# EAGLE design pentabug_1layer (EAGLE 6.2)
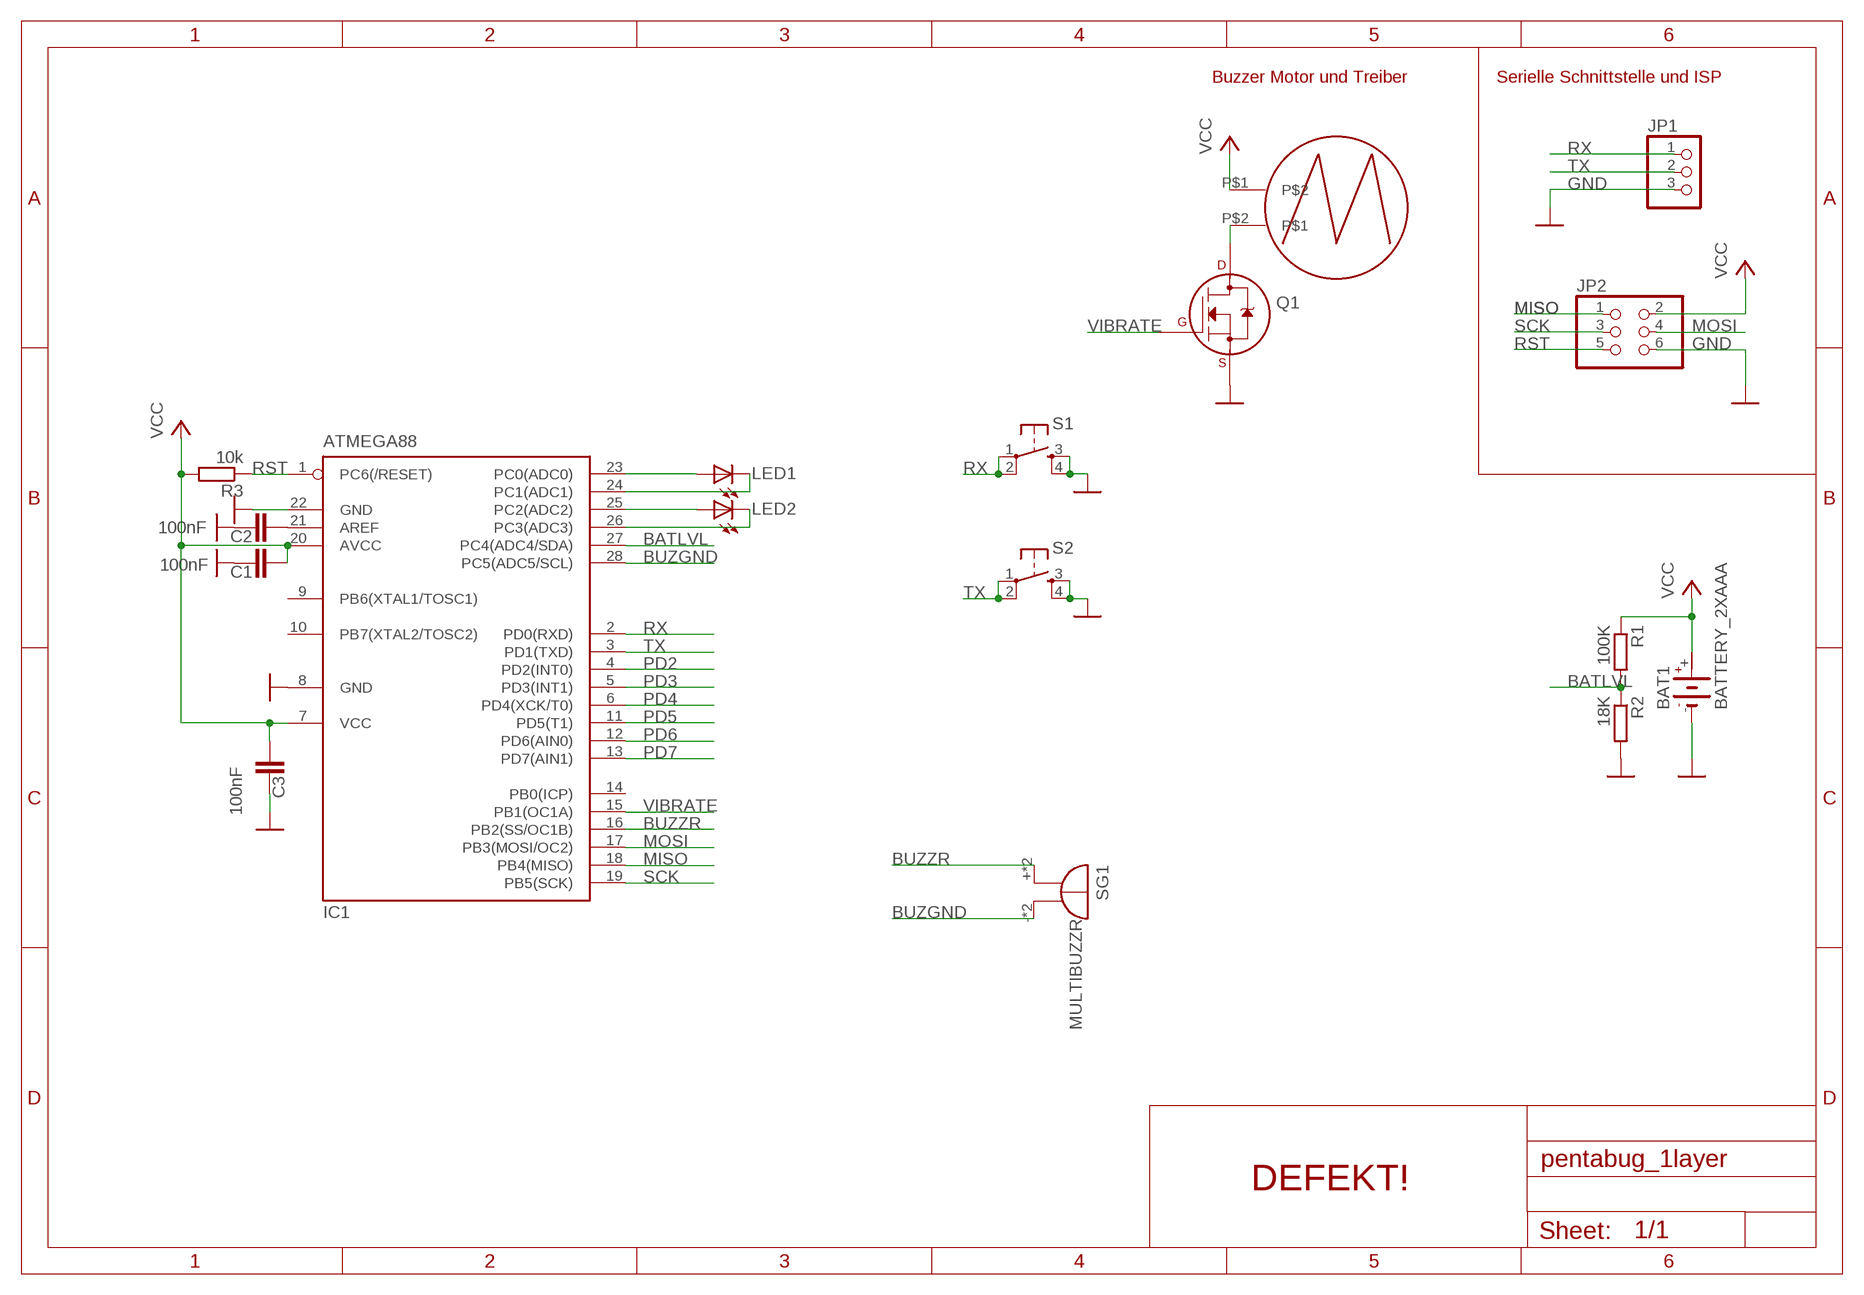
[diagram p0: schematic, sheet 1]

## Parts
BAT1  BATTERY_2XAAA  [BATTERY_2XAAA]
C1  100nF  C-EU025-024X044  [C025-024X044]
C2  100nF  C-EU025-024X044  [C025-024X044]
C3  100nF  C-EU025-024X044  [C025-024X044]
IC1  ATMEGA88  MEGA8-P  [DIL28-3]
JP1  PINHD-1X3  [1X03]
JP2  PINHD-2X3  [2X03]
LED1  LED5MM  [LED5MM]
LED2  LED5MM  [LED5MM]
Q1  2N7000_TO92  [TO-92]
R1  100K  R-EU_0207/10  [0207/10]
R2  18K  R-EU_0207/10  [0207/10]
R3  10k  R-EU_0207/10  [0207/10]
S1  TAC_SWITCHPTH  [TACTILE-PTH]
S2  TAC_SWITCHPTH  [TACTILE-PTH]
SG1  MULTIBUZZR  [MULTIBUZZR]
U$1  VIBRAMOTOR  [LA4-432]

## Nets
BATLVL: IC1.27(PC4(ADC4/SDA)) R1.2 R2.1
BATTLVL: IC1.26(PC3(ADC3)) LED2.K(C)
BUZGND: IC1.28(PC5(ADC5/SCL)) SG1.- SG1.-1(-)
BUZZR: IC1.16(PB2(SS/OC1B)) SG1.+ SG1.+1(+)
GND: BAT1.- C1.1 C2.1 C3.1 IC1.8(GND) IC1.22(GND) JP1.3 JP2.6 Q1.1(S) R2.2 S1.3 S1.4 S2.3 S2.4
MISO: IC1.18(PB4(MISO)) JP2.1
MOSI: IC1.17(PB3(MOSI/OC2)) JP2.4
N$3: IC1.23(PC0(ADC0)) LED1.A
N$5: IC1.25(PC2(ADC2)) LED2.A
N$8: Q1.3(D) U$1.P$2
N$10: IC1.24(PC1(ADC1)) LED1.K(C)
N$17: C2.2 IC1.21(AREF)
PD2: IC1.4(PD2(INT0))
PD3: IC1.5(PD3(INT1))
PD4: IC1.6(PD4(XCK/T0))
PD5: IC1.11(PD5(T1))
PD6: IC1.12(PD6(AIN0))
PD7: IC1.13(PD7(AIN1))
RST: IC1.1(PC6(/RESET)) JP2.5 R3.1
RX: IC1.2(PD0(RXD)) JP1.1 S1.1 S1.2
SCK: IC1.19(PB5(SCK)) JP2.3
TX: IC1.3(PD1(TXD)) JP1.2 S2.1 S2.2
VCC: BAT1.+ C1.2 C3.2 IC1.7(VCC) IC1.20(AVCC) JP2.2 R1.1 R3.2 U$1.P$1
VIBRATE: IC1.15(PB1(OC1A)) Q1.2(G)
Unconnected: IC1.9(PB6(XTAL1/TOSC1)) IC1.10(PB7(XTAL2/TOSC2)) IC1.14(PB0(ICP))

## Notes on the sheet
- Buzzer Motor und Treiber | Serielle Schnittstelle und ISP
- DEFEKT!

## Library data of the parts
BAT1 = seb:BATTERY_2XAAA: Farnell Battery Holder 2x AAA Farnell # 1650679
C1-C3 = resistor:C-EU: CAPACITOR, European symbol
IC1 = atmel:MEGA8-P: MICROCONTROLLER 8 Kbytes FLASH, 1 kbytes SRAM, 512 bytes EEPROM, USART, 4-channel 10 bit ADC, 2-channel 8 bit ADC Pin compatible with Atmega48, ATMega88, ATMega168 Source: avr.lbr; OC_FARNELL: unknown; OC_NEWARK: unknown
JP1 = pinhead:PINHD-1X3: PIN HEADER
JP2 = pinhead:PINHD-2X3: PIN HEADER
LED1 LED2 = SparkFun:LED: LEDs Standard schematic elements and footprints for 5mm, 3mm, 1206, and 0603 sized LEDs. 5mm - Spark Fun Electronics SKU : COM-00529 (and others)
Q1 = transistors:2N700*: 2N7000, 2N7002, NDS7002A N-channel enhancement mode MOSFET
R1-R3 = rcl:R-EU_: RESISTOR, European symbol
S1 S2 = SparkFun:TAC_SWITCH: Momentary Switch Button commonly used for reset or general input. Spark Fun Electronics SKU : COM-00097
SG1 = buglbr:MULTIBUZZR: BUZZER Source: Buerklin; OC_FARNELL: unknown; OC_NEWARK: unknown
U$1 = buglbr:VIBRAMOTOR

## Board
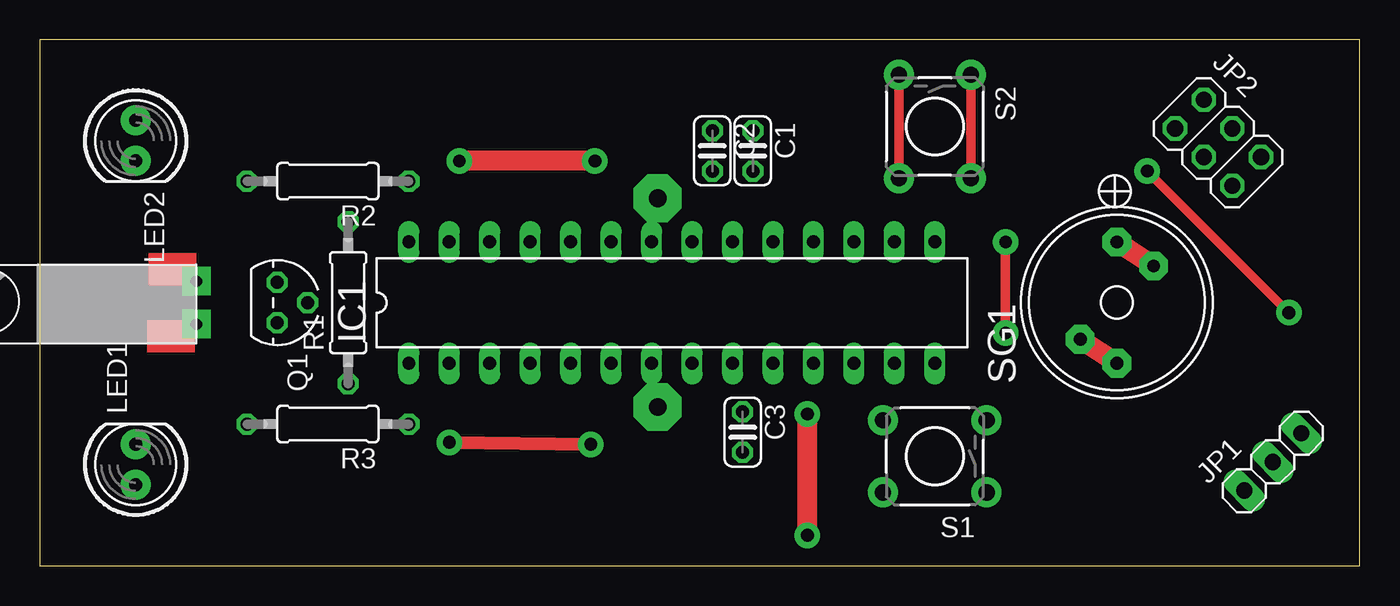
[diagram p1: board, top side]
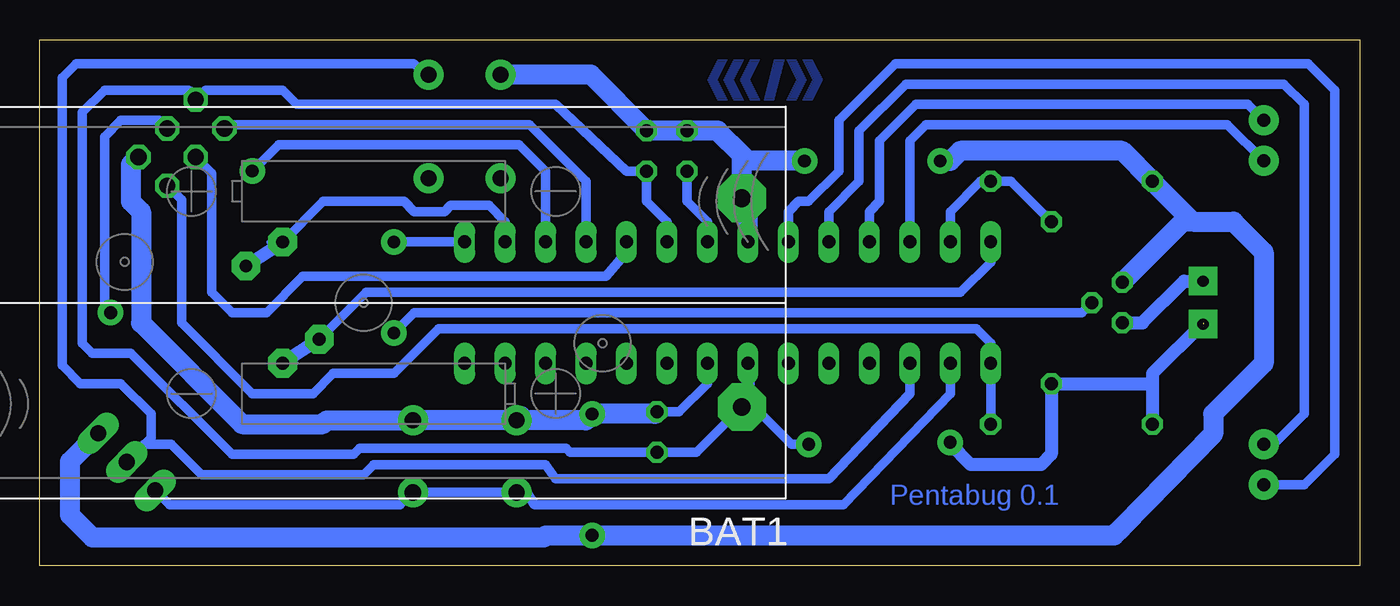
[diagram p2: board, bottom side, seen from below]

Size 82.85 x 33 mm. Coordinates in mm from the lower left corner, seen from the top.
Outline: 82.85,0 82.85,33 0,33 0,0 82.85,0
Copper layers (1*16): Top 0.035mm / dielectric 1.5mm / Bottom 0.035mm
Design rules: minimum track width 10mil, minimum drill 0.6mm, track to track 8mil, track to pad 8mil, pad to pad 8mil, via to via 8mil, smd to smd 8mil, copper to edge 40mil, drill to drill 8mil, minimum pad ring 10mil, minimum via ring 8mil, stop-mask expansion 4mil, vias tented up to drill 0mil, thermal gap 10mil

### Footprints (pad centres in the part's own frame; a part is rotated, then mirrored left to right if it is on the bottom)
BATTERY_2XAAA = drill 1.1 pad 3 octagon: + -23.75,6.55; - -23.75,-6.55
C025-024X044 = drill 0.813 octagon: 1 -1.27,0; 2 1.27,0
DIL28-3 = drill 0.813 long: 1 -16.51,-3.81; 2 -13.97,-3.81; 3 -11.43,-3.81; 4 -8.89,-3.81; 5 -6.35,-3.81; 6 -3.81,-3.81; 7 -1.27,-3.81; 8 1.27,-3.81; 9 3.81,-3.81; 10 6.35,-3.81; 11 8.89,-3.81; 12 11.43,-3.81; 13 13.97,-3.81; 14 16.51,-3.81; 15 16.51,3.81; 16 13.97,3.81; 17 11.43,3.81; 18 8.89,3.81; 19 6.35,3.81; 20 3.81,3.81; 21 1.27,3.81; 22 -1.27,3.81; 23 -3.81,3.81; 24 -6.35,3.81; 25 -8.89,3.81; 26 -11.43,3.81; 27 -13.97,3.81; 28 -16.51,3.81
1X03 = drill 1.016 long: 1 -2.54,0; 2 0,0; 3 2.54,0
2X03 = drill 1.016 octagon: 1 -2.54,-1.27; 2 -2.54,1.27; 3 0,-1.27; 4 0,1.27; 5 2.54,-1.27; 6 2.54,1.27
LED5MM = drill 0.813 pad 1.88: A -1.27,0; K 1.27,0
TO-92 = drill 0.813 octagon: 1 -1.27,0; 2 0,1.905; 3 1.27,0
0207/10 = drill 0.813 octagon: 1 -5.08,0; 2 5.08,0
TACTILE-PTH = drill 1.016 pad 1.88: 1 -3.251,2.261; 2 3.251,2.261; 3 -3.251,-2.261; 4 3.251,-2.261
MULTIBUZZR = drill 0.8 pad 1.8 octagon: + 3.8,0; +1 2.3,-2.3; - -3.8,0; -1 -2.3,2.3
LA4-432 = drill 0.7 pad 1.778 square: P$1 -6.985,1.35; P$2 -6.985,-1.35

### Placement (x,y rotation side)
BAT1  62.53,16.51 180 bottom
C1  44.75,26.04 270 top
C2  42.21,26.04 270 top
C3  44.12,8.38 270 top
IC1  39.67,16.51 0 top
JP1  77.4,6.51 45 top
JP2  73.97,26.54 315 top
LED1  6.02,6.35 90 top
LED2  6.02,26.67 270 top
Q1  14.91,16.51 270 top
R1  19.36,16.51 90 top
R2  18.09,24.13 180 top
R3  18.09,8.89 180 top
S1  56.18,6.86 180 top
S2  56.18,27.56 270 top
SG1  67.61,16.51 90 top
U$1  2.85,16.51 180 top

### Tracks (layer width: path | path; a pad name or v marks a point on that pad's centre or on a via)
BATLVL
  Bottom 0.61: IC1.27 25.71,22.23 23.8,24.13 R2.1 21.89,24.13 R1.2
BATTLVL
  Bottom 0.61: IC1.26 28.25,26.67 27.23,27.69 8.31,27.69 LED2.K
BUZGND
  Bottom 0.406: SG1.- 66.81,12.71
  Bottom 0.61: IC1.28 23.16,19.05 25.07,17.14 62.38,17.14 SG1.-1
  Bottom 0.813: SG1.-1 SG1.-
BUZZR
  Bottom 0.406: 68.41,20.31 SG1.+ 67.61,20.96
  Bottom 0.61: IC1.16 53.64,21.59 54.66,22.61 57.06,22.61 57.44,22.23 59.36,22.23 59.99,22.86 65.06,22.86 SG1.+ 67.36,20.31
  Bottom 0.813: SG1.+1 SG1.+
GND  (via drill 0.8 pad 1.6)
  Top 0.61: S2.3 S2.4
  Top 1.27: v34.85,25.4 v26.34,25.4 | v48.18,1.9 v48.18,9.53
  Bottom 0.61: 25.71,25.4 v26.34,25.4 | IC1.8 40.94,11.43 42.72,9.65 C3.1
  Bottom 1.27: IC1.22 38.4,22.68 BAT1.- 38.78,25.78 | 38.78,25.78 40.31,27.3 C2.1 C1.1 48.26,30.81 S2.3 | 25.71,25.4 25.07,26.04 14.91,26.04 R2.2 10.46,21.59 | JP2.6 77.14,25.16 77.14,22.86 76.5,22.23 76.5,15.24 70.16,8.89 65.08,8.89 64.85,9.12 S1.3 S1.4 | 10.46,21.59 7.93,21.59 6.02,19.68 6.02,12.7 9.2,9.53 9.2,8.26 14.91,2.41 15.42,1.9 v48.18,1.9 51.1,1.9 51.23,1.78 79.55,1.78 80.95,3.18 80.95,6.55 JP1.3 | v34.85,25.4 38.4,25.4 38.78,25.78 | 52.65,9.4 S1.4 | C3.1 44.25,9.53 v48.18,9.53 48.59,9.12 S1.4 | 10.46,21.59 11.1,21.59 Q1.1
MISO
  Bottom 0.61: IC1.18 48.56,24.13 52.12,27.69 70.88,27.69 JP2.1
MOSI  (via drill 0.8 pad 1.6)
  Top 0.61: v69.52,24.77 v78.41,15.88
  Bottom 0.61: IC1.17 51.1,24.77 52.76,26.42 67.87,26.42 v69.52,24.77 | JP2.4 75.36,27.94 77.77,27.94 78.79,26.92 78.79,16.26 v78.41,15.88
N$1
  pour Bottom: 40.31,31.75 40.94,30.48 40.31,29.21 39.67,29.21 40.31,30.48 39.67,31.75
  pour Bottom: 39.29,31.75 39.93,30.48 39.29,29.21 38.66,29.21 39.29,30.48 38.66,31.75
  pour Bottom: 38.28,31.75 38.91,30.48 38.28,29.21 37.64,29.21 38.28,30.48 37.64,31.75
  pour Bottom: 34.34,29.21 33.71,30.48 34.34,31.75 34.98,31.75 34.34,30.48 34.98,29.21
  pour Bottom: 35.36,29.21 34.72,30.48 35.36,31.75 35.99,31.75 35.36,30.48 35.99,29.21
N$2
  pour Bottom: 37.39,29.21 36.75,31.75 36.12,31.75 36.75,29.21
N$3
  Bottom 0.61: IC1.23 35.86,22.23 35.23,22.86 34.59,22.86 32.69,24.77 32.69,27.94 29.13,31.5 3.23,31.5 1.58,29.84 1.58,6.99 3.48,5.08 LED1.A
N$5
  Bottom 0.61: IC1.25 30.79,22.23 30.15,22.86 30.15,26.67 27.86,28.96 7.04,28.96 LED2.A
N$8
  Bottom 0.813: Q1.3 13.64,15.24 11.02,17.86 U$1.P$2
N$10
  Bottom 0.61: IC1.24 33.32,22.23 31.42,24.13 31.42,27.3 28.5,30.23 4.75,30.23 3.48,28.96 3.48,9.53 5.38,7.62 LED1.K
N$17
  Bottom 0.61: IC1.21 40.94,21.59 42.21,22.86 C2.2
RST
  Bottom 0.61: R3.1 IC1.1 23.16,13.97 24.05,14.86 57.84,14.86 60.63,12.07 64.44,12.07 65.71,10.79 69.52,10.79 73.97,15.24 73.97,22.95 JP2.5
RX
  Bottom 0.61: IC1.2 25.71,10.79 32.41,3.84 51.79,3.84 52.3,4.6 S1.2 S1.1 60.22,3.81 74.7,3.81 JP1.1
SCK
  Bottom 0.61: IC1.19 46.02,19.68 47.29,18.16 66.34,18.16 68.63,15.88 70.79,15.88 72.06,17.14 72.06,24.64 JP2.3
TX
  Top 0.61: S2.2 S2.1
  Bottom 0.61: IC1.3 28.25,10.79 33.32,5.46 50.47,5.46 51.1,6.35 61.9,6.35 62.53,5.71 72.69,5.71 74.6,7.62 76.29,7.62 JP1.2 75.87,8.04 75.87,9.53 77.77,11.43 80.31,11.43 81.46,12.57 81.46,30.61 80.57,31.5 59.38,31.5 S2.1
VCC  (via drill 0.8 pad 1.6)  (1 unrouted)
  Top 0.813: v25.71,7.75 v34.59,7.62
  Bottom 0.61: IC1.20 43.48,21.59 44.75,22.86 C1.2 46.02,24.77 50.47,28.96 66.73,28.96 67.61,29.84 72.46,29.84 JP2.2 arc-90 73.67,29.84 78.79,29.84 80.19,28.45 80.19,13.97 79.55,13.34 77.14,13.34 70.79,6.99 63.17,6.99 62.79,7.37 49.83,7.37 49.58,7.11 C3.2 41.63,7.11 BAT1.+ | 38.4,10.34 35.68,7.62 v34.59,7.62
  Bottom 0.813: IC1.7 38.4,10.34 arc90 BAT1.+ | 9.83,15.24 13.01,12.07 13.01,11.43 | 13.01,11.43 R3.2 | 13.01,11.43 R1.1 19.36,6.99 19.99,6.35 24.43,6.35 25.71,7.62 v25.71,7.75
VIBRATE  (via drill 0.8 pad 1.6)
  Top 0.61: v60.63,14.61 v60.63,20.32
  Bottom 0.61: Q1.2 17.45,15.88 59.36,15.88 v60.63,14.61 | v60.63,20.32 IC1.15

### Text on the board
Bottom: Pentabug 0.1